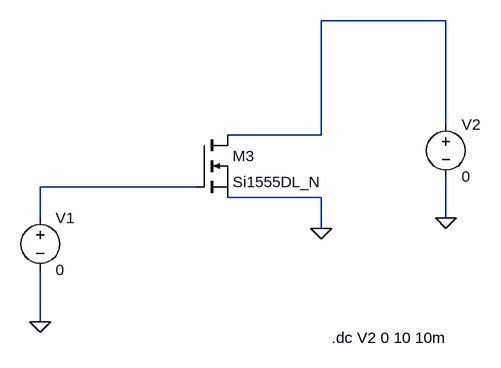
[diagram p0: schematic MOSchar.asc]
MOSchar.asc, the LTspice schematic file:
Version 4
SHEET 1 2508 1832
WIRE -224 1328 -416 1328
WIRE -224 1488 -224 1328
WIRE -416 1504 -416 1328
WIRE -416 1504 -560 1504
WIRE -608 1584 -848 1584
WIRE -416 1600 -560 1600
WIRE -848 1632 -848 1584
WIRE -224 1632 -224 1568
WIRE -416 1648 -416 1600
WIRE -848 1792 -848 1712
FLAG -416 1648 0
FLAG -848 1792 0
FLAG -224 1632 0
SYMBOL nmos -608 1504 R0
SYMATTR InstName M3
SYMATTR Value Si1555DL_N
SYMBOL voltage -848 1616 R0
WINDOW 123 0 0 Left 2
WINDOW 39 0 0 Left 2
SYMATTR InstName V1
SYMATTR Value 0
SYMBOL voltage -224 1472 R0
WINDOW 123 0 0 Left 2
WINDOW 39 0 0 Left 2
SYMATTR InstName V2
SYMATTR Value 0
TEXT -400 1816 Left 2 !.dc V2 0 10 10m

The netlist it stands for:
* MOSchar.asc
M3 N001 N002 0 0 Si1555DL_N
V1 N002 0 0
V2 N001 0 0
.model NMOS NMOS
.model PMOS PMOS
.lib standard.mos
.dc V2 0 10 10m
.backanno
.end